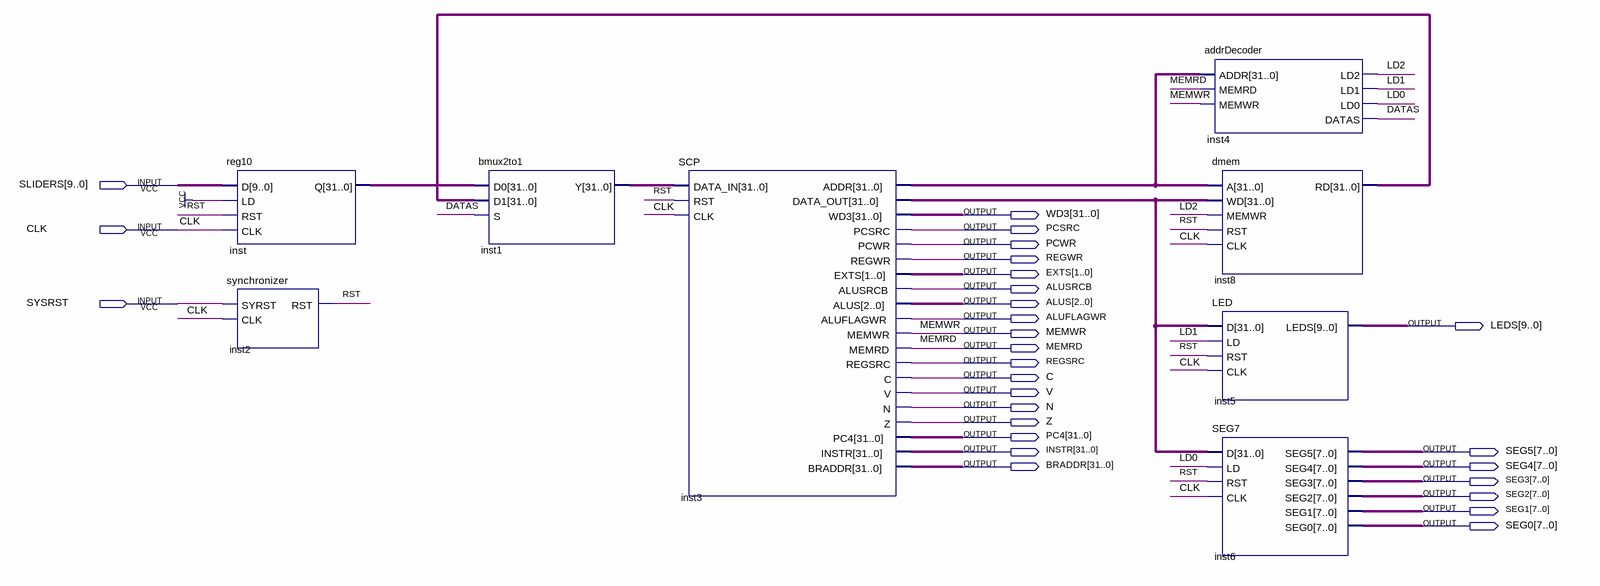
[diagram p0: schematic sheet]
// Quartus schematic SCPFPGA.bdf as structural Verilog: 8 symbols, 28 pins
module SCPFPGA (
  input  [9:0] SLIDERS,
  input  CLK,
  input  SYSRST,
  output [31:0] WD3,
  output PCSRC,
  output PCWR,
  output REGWR,
  output [1:0] EXTS,
  output ALUSRCB,
  output [2:0] ALUS,
  output ALUFLAGWR,
  output [9:0] LEDS,
  output MEMWR,
  output MEMRD,
  output REGSRC,
  output C,
  output V,
  output N,
  output Z,
  output [31:0] PC4,
  output [31:0] INSTR,
  output [7:0] SEG5,
  output [31:0] BRADDR,
  output [7:0] SEG4,
  output [7:0] SEG3,
  output [7:0] SEG2,
  output [7:0] SEG1,
  output [7:0] SEG0
);

  wire DATAS, LD0, LD1, LD2, RST;
  wire [31:0] inst1_y, inst3_addr, inst3_data_out, inst8_rd, inst_q;

  reg10 inst (.D(SLIDERS), .LD(1'b1), .RST(RST), .CLK(CLK), .Q(inst_q));
  synchronizer inst2 (.SYRST(SYSRST), .CLK(CLK), .RST(RST));
  bmux2to1 inst1 (.D0(inst_q), .D1(inst8_rd), .S(DATAS), .Y(inst1_y));
  SCP inst3 (
    .DATA_IN(inst1_y), .RST(RST), .CLK(CLK), .ADDR(inst3_addr), .DATA_OUT(inst3_data_out), .WD3(WD3),
    .PCSRC(PCSRC), .PCWR(PCWR), .REGWR(REGWR), .EXTS(EXTS), .ALUSRCB(ALUSRCB), .ALUS(ALUS),
    .ALUFLAGWR(ALUFLAGWR), .MEMWR(MEMWR), .MEMRD(MEMRD), .REGSRC(REGSRC), .C(C), .V(V), .N(N), .Z(Z),
    .PC4(PC4), .INSTR(INSTR), .BRADDR(BRADDR));
  addrDecoder inst4 (.ADDR(inst3_addr), .MEMRD(MEMRD), .MEMWR(MEMWR), .LD2(LD2), .LD1(LD1), .LD0(LD0), .DATAS(DATAS));
  dmem inst8 (.A(inst3_addr), .WD(inst3_data_out), .MEMWR(LD2), .RST(RST), .CLK(CLK), .RD(inst8_rd));
  LED inst5 (.D(inst3_data_out), .LD(LD1), .RST(RST), .CLK(CLK), .LEDS(LEDS));
  SEG7 inst6 (
    .D(inst3_data_out), .LD(LD0), .RST(RST), .CLK(CLK), .SEG5(SEG5), .SEG4(SEG4), .SEG3(SEG3), .SEG2(SEG2),
    .SEG1(SEG1), .SEG0(SEG0));
endmodule
